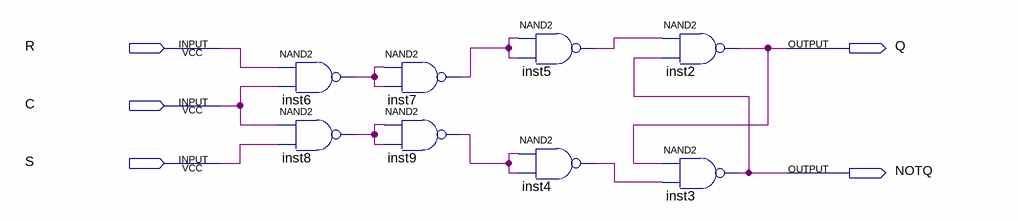
[diagram p0: schematic sheet]
// Quartus schematic Lab_5_2.bdf as structural Verilog: 8 symbols, 5 pins
module Lab_5_2 (
  input  R,
  input  C,
  input  S,
  output Q,
  output NOTQ
);

  wire inst4_out, inst5_out, inst6_out, inst7_out, inst8_out, inst9_out;

  nand inst6 (inst6_out, R, C);
  nand inst8 (inst8_out, C, S);
  nand inst7 (inst7_out, inst6_out, inst6_out);
  nand inst9 (inst9_out, inst8_out, inst8_out);
  nand inst5 (inst5_out, inst7_out, inst7_out);
  nand inst4 (inst4_out, inst9_out, inst9_out);
  nand inst2 (Q, inst5_out, NOTQ);
  nand inst3 (NOTQ, Q, inst4_out);
endmodule
